# Altium schematic sheet 3_Power &amp; Peripherals.schdoc
size 307 x 218 mm; Symbol: Artery_A4; Device: Artery_A4; @Project Name: AT-START-F422/F426; @Page Count: 4; @Create Date: 2025-04-14; Company: Artery Technology; Drawed: SD; Version: 1.0; Page Size: A4; @Update Date: 2025-04-14; @Page No: 3; @Schematic Name: AT-START-F426-V1.0; @Page Name: Power &amp; Peripherals; Title Block Position: 3; Width: 1170; Height: 825; Region Start: 1; X Region Count: 6; Y Region Count: 4; Blade Width: 10; @Board Name: AT-START-F426-V1.0; @Create Time: 11:42:27; @Update Time: 14:57:24
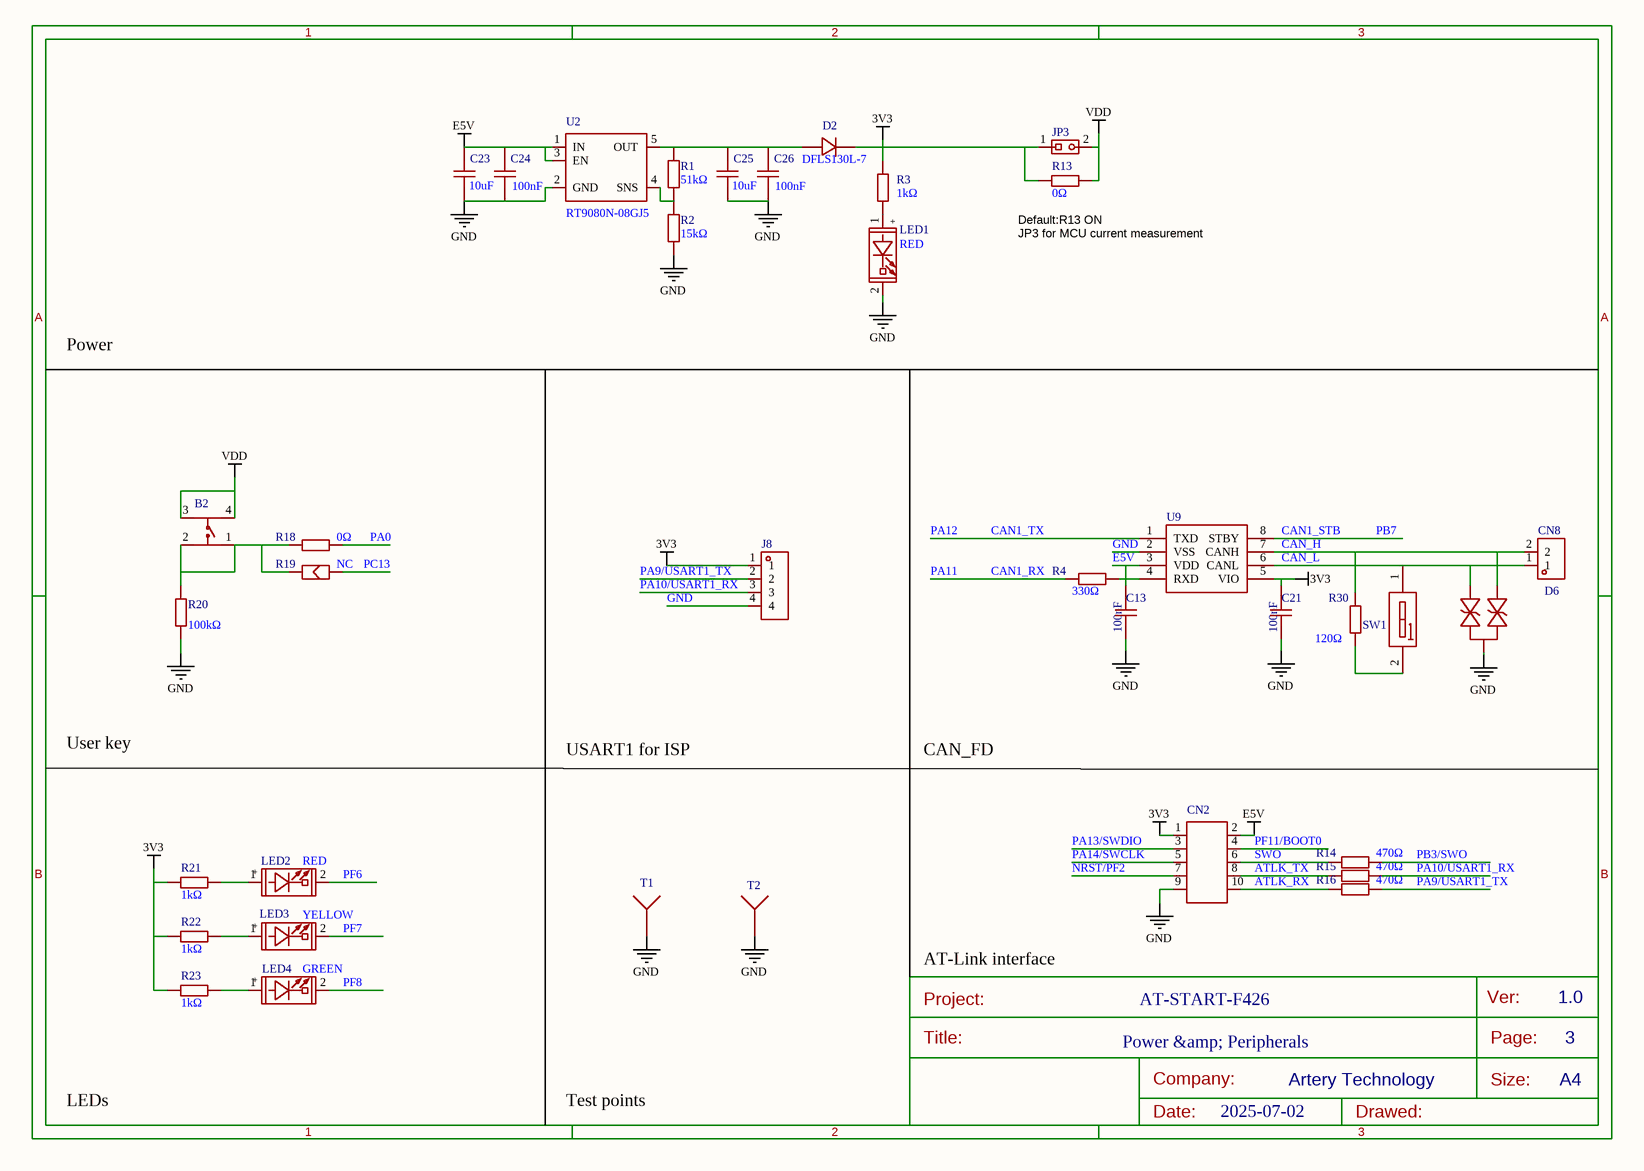
[diagram p0: 3_Power &amp; Peripherals.schdoc]

## Parts
B2  TSA063G60-250  [KEY-SMD_4P-L6.1-W6.1-P4.50-LS9.0]  (value not drawn)
C13  100nF  [C0603]
C21  100nF  [C0603]
C23  10uF  [C0603]
C24  100nF  [C0603]
C25  10uF  [C0603]
C26  100nF  [C0603]
CN2  CON10  [HDR2X5]  (value not drawn)
CN8  KF301-5.0-2P  [CONN-TH_P5.00_KF301-5.0-2P]  (value not drawn)
D2  DFLS130L-7  [POWERDI-123_L2.8-W1.8-LS3.7-RD]
D6  PESD2CANFD24V-TR  [SOT-23-3_L2.9-W1.3-P1.90-LS2.4-BR]  (value not drawn)
J8  PZ2.54-1*4-WZ  [HDR-TH_4P-P2.54-H-M-W7.7-P]  (value not drawn)
JP3  1X2P_2.54M  [HDR1X2]  (value not drawn)
LED1  RED  [LED0603]
LED2  RED  [LED0603]
LED3  YELLOW  [LED0603]
LED4  GREEN  [LED0603]
R1  51kΩ  [R0603]
R2  15kΩ  [R0603]
R3  1kΩ  [R0603]
R4  330Ω  [R0603]
R13  0Ω  [SB-PAD_2]
R14  470Ω  [R0603]
R15  470Ω  [R0603]
R16  470Ω  [R0603]
R18  0Ω  [SB-PAD_2]
R19  NC  [SB-PAD_2]
R20  100kΩ  [R0603]
R21  1kΩ  [R0603]
R22  1kΩ  [R0603]
R23  1kΩ  [R0603]
R30  120Ω  [R0603]
SW1  DSWB01LHGET  [SW-TH_DSWB01LHGET]  (value not drawn)
T1  Test point  [TestPoint]  (value not drawn)
T2  Test point  [TestPoint]  (value not drawn)
U2  RT9080N-08GJ5  [SOT-23-5]
U9  MCP2562FD-E/SN  [SOIC-8_L4.9-W3.9-P1.27-LS6.0-BL]  (value not drawn)

## Nets
3V3: C21.2 CN2.1 D2.1 J8.1 JP3.1 R3.2 R13.2 R21.2 R22.2 R23.2 U9.5(VIO)
E5V: C13.2 C23.1 C24.1 CN2.2 U2.1(IN) U2.3(EN) U9.3(VDD)
GND: C13.1 C21.1 C23.2 C24.2 C25.2 C26.2 CN2.9 D6.3 J8.4 LED1.2(CATHODE) R2.2 R20.2 T1.1 T2.1 U2.2(GND) U9.2(VSS)
VDD: B2.3 B2.4 JP3.2 R13.1
ATLK_RX: CN2.10 R16.2
ATLK_TX: CN2.8 R15.2
CAN1_RX: R4.1  [also labelled PA11]
CAN1_STB: U9.8(STBY)  [also labelled PB7]
CAN1_TX: U9.1(TXD)  [also labelled PA12]
CAN_H: CN8.2 D6.1 R30.2 U9.7(CANH)
CAN_L: CN8.1 D6.2 SW1.1(A1) U9.6(CANL)
NRST/PF2: CN2.7
PA0: R18.1
PA9/USART1_TX: J8.2 R16.1
PA10/USART1_RX: J8.3 R15.1
PA13/SWDIO: CN2.3
PA14/SWCLK: CN2.5
PB3/SWO: R14.1
PC13: R19.1
PF6: LED2.2(CATHODE)
PF7: LED3.2(CATHODE)
PF8: LED4.2(CATHODE)
PF11/BOOT0: CN2.4
SWO: CN2.6 R14.2
NetB2_1: B2.1 B2.2 R18.2 R19.2 R20.1
NetC25_1: C25.1 C26.1 D2.2 R1.1 U2.5(OUT)
NetLED1_1: LED1.1(ANODE) R3.1
NetLED2_1: LED2.1(ANODE) R21.1
NetLED3_1: LED3.1(ANODE) R22.1
NetLED4_1: LED4.1(ANODE) R23.1
NetR1_2: R1.2 R2.1 U2.4(SNS)
NetR4_2: R4.2 U9.4(RXD)
NetR30_1: R30.1 SW1.2

## Notes on the sheet
- (near R13) JP3 for MCU current measurement
- (near R13) Default:R13 ON
- Power
- User key
- USART1 for ISP
- CAN_FD
- AT-Link interface
- AT-START-F426
- LEDs
- Test points
- 2025-07-02
- 1
- 2
- 3
- A
- B
- Title:
- Project:
- Power &amp; Peripherals
- Page:
- Ver:
- 1.0
- Date:
- Company:
- Drawed:
- Artery Technology
- Size:
- A4
- (in symbol GREEN) +
- (in symbol RED) +
- (in symbol YELLOW) +

## Library data of the parts
B2 = TSA063G60-250: Manufacturer: BRIGHT(博瑞泰); Add into BOM: yes; Circuit: 单刀单掷; Actuator Style: 圆形按钮; Operating Force: 250gf; Switch Length: 6.1mm; Switch Height: 6mm; Strike Gundam: 不带; Contact Current: 50mA; Voltage Rating (DC): 12V; Insulation Resistance: 100MΩ; Actuator/Cap Color: 黑色; With Lamp: 无; Pin Style: 鸥翼型; Mechanical Life: 5万次; Origin Footprint: KEY_SOP_6*6; Symbol: TSA063G60-250; Device: TSA063G60-250; LCSC Part Name: 6.1*6.1*6mm 立贴 轻触开关; Supplier Part: C294566; Manufacturer Part: TSA063G60-250; Supplier Footprint: SMD; JLCPCB Part Class: Extended Part; Datasheet: https://atta.szlcsc.com/upload/public/pdf/source/20181029/C294570_15EFF1F4D215547575AD6307D8A439BB.pdf; Supplier: LCSC; Convert to PCB: yes; Mounting Style: 立贴; Switch Width: 6.1mm; Operating Temperature: -25℃~+70℃; Design Item ID: Push_Bottom,Blue,SMD_2P; Library Name: *
C13 C21 = CC0603KRX7R9BB104: Manufacturer: YAGEO(国巨); Add into BOM: yes; Tolerance: ±10%; Voltage Rated: 50V; Temperature Coefficient: X7R; Symbol: CC0603KRX7R9BB104; Device: CC0603KRX7R9BB104; Supplier: LCSC; Manufacturer Part: CC0603KRX7R9BB104; Value: 100nF; Supplier Part: C14663; JLCPCB Part Class: Basic Part; LCSC Part Name: 100nF ±10% 50V; Supplier Footprint: 0603; Datasheet: https://atta.szlcsc.com/upload/public/pdf/source/20180910/C282072_33301C7F631E79921B82A8DAC6BCC5B3.pdf; Convert to PCB: yes
C23 C25 = CL10A106KP8NNNC: Manufacturer: SAMSUNG(三星); Add into BOM: yes; Tolerance: ±10%; Voltage Rated: 10V; Temperature Coefficient: X5R; Origin Footprint: 0603_C-M; Symbol: CL10A106KP8NNNC; Device: CL10A106KP8NNNC; Supplier: LCSC; Manufacturer Part: CL10A106KP8NNNC; Value: 10uF; Supplier Part: C19702; JLCPCB Part Class: Basic Part; LCSC Part Name: 10uF ±10% 10V; Supplier Footprint: 0603; Datasheet: https://atta.szlcsc.com/upload/public/pdf/source/20160218/1457707763339.pdf; Convert to PCB: yes
C24 C26 = CC0603KRX7R9BB104: Manufacturer: YAGEO(国巨); Add into BOM: yes; Tolerance: ±10%; Voltage Rated: 50V; Temperature Coefficient: X7R; Origin Footprint: 0603_C-M; Symbol: CC0603KRX7R9BB104; Device: CC0603KRX7R9BB104; Supplier: LCSC; Manufacturer Part: CC0603KRX7R9BB104; Value: 100nF; Supplier Part: C14663; JLCPCB Part Class: Basic Part; LCSC Part Name: 100nF ±10% 50V; Supplier Footprint: 0603; Datasheet: https://atta.szlcsc.com/upload/public/pdf/source/20180910/C282072_33301C7F631E79921B82A8DAC6BCC5B3.pdf; Convert to PCB: yes
CN2 = CON10: Symbol: CON10A_0; Add into BOM: yes; Device: CON10; Convert to PCB: yes; Origin Footprint: HDR2X5; Design Item ID: CON10A_0; Library Name: *
CN8 = KF301-5.0-2P: Manufacturer: KEFA(科发); Add into BOM: yes; Structure: 1x2P; Pitch: 5mm; Current Rating (Max): 17A; Voltage Rating (Max): 250V; Wire Gauge - AWG: 14~22; Wire Gauge - mm2: 1.5; Number of PINs Per Row: 2; Symbol: KF301-5.0-2P; Device: KF301-5.0-2P; LCSC Part Name: 5mm 1x2P 排数:1 每排P数:2 直插; Supplier Part: C474881; Manufacturer Part: KF301-5.0-2P; Supplier Footprint: 插件,P=5mm; JLCPCB Part Class: 扩展库; Datasheet: https://atta.szlcsc.com/upload/public/pdf/source/20230317/03A5B5FC229D6F9225E8F51DA1A4E80A.pdf; Supplier: LCSC; Convert to PCB: yes; Color: 蓝色; Mounting Style: 直插; Number of Pins: 2P; Number of Rows: 1; Operating Temperature Range: -30℃~+120℃
D2 = DFLS130L-7: Manufacturer: DIODES(美台); Add into BOM: yes; Forward Voltage (Vf@If): 310mV@1A; Reverse Voltage (Vr): 30V; Average Rectified Current (Io): 1A; Origin Footprint: SOD-123; Symbol: DFLS130L-7; Device: DFLS130L-7; LCSC Part Name: 电压:30V 电流:1A; Supplier Part: C110493; Manufacturer Part: DFLS130L-7; Supplier Footprint: Power-DI-123; JLCPCB Part Class: Extended Part; Datasheet: https://atta.szlcsc.com/upload/public/pdf/source/20170427/1493286393645.pdf; Supplier: LCSC; Convert to PCB: yes; Design Item ID: Diode; Library Name: Miscellaneous Devices; Published: 8-Jun-2000; LatestRevisionDate: 17-Jul-2002; LatestRevisionNote: Re-released for DXP Platform.; PackageVersion: Sep-1996; PackageReference: SMC; Publisher: Altium Limited; PackageDescription: DO-214-AB/SMC; 2 C-Bend Leads; Body 7.9 x 5.9 mm, inc. leads (LxW); Code_JEDEC: DO-214-AB
D6 = PESD2CANFD24V-TR: Manufacturer: Nexperia(安世); Add into BOM: yes; Reverse Stand-Off Voltage (Vrwm): 24V; Maximum Clamping Voltage: 42V; Breakdown Voltage: 25.5V; Type: ESD; Symbol: PESD2CANFD24V-TR; Device: PESD2CANFD24V-TR; LCSC Part Name: PESD2CANFD24V-TR; Supplier Part: C552486; Manufacturer Part: PESD2CANFD24V-TR; Supplier Footprint: SOT-23; JLCPCB Part Class: Extended Part; Datasheet: https://atta.szlcsc.com/upload/public/pdf/source/20200610/C552486_699511E714443C7808A8CCDBC78334D2.pdf; Supplier: LCSC; Convert to PCB: yes; Peak Pulse Power Dissipation (Ppp)@10/1000us: -; Operating Temperature: -55℃~+175℃@(Ta)
J8 = PZ2.54-1*4-WZ: Manufacturer: ZHOURI(洲日); Add into BOM: yes; Pin Structure: 1x4P; Pitch: 2.54mm; Origin Footprint: HDR1X4; Symbol: PZ2.54-1*4-WZ; Device: PZ2.54-1*4-WZ; LCSC Part Name: PZ2.54-1*4-WZ; Supplier Part: C5224015; Manufacturer Part: PZ2.54-1*4-WZ; Supplier Footprint: 弯插,P=2.54mm; JLCPCB Part Class: Extended Part; Datasheet: https://atta.szlcsc.com/upload/public/pdf/source/20221031/5E07F614DEAC37F80EB82945E6A3298C.pdf; Supplier: LCSC; Convert to PCB: yes; Mounting Type: 弯插; Number of Rows: 单排; Number of Pins: 4P; Contact Plating: 金; Design Item ID: Header 4; Library Name: Miscellaneous Connectors; LatestRevisionDate: 17-Jul-2002; LatestRevisionNote: Re-released for DXP Platform.; Publisher: Altium Limited
JP3 = 1X2P_2.54M: Symbol: 1X2P,Male,DIP_2.54; Origin Footprint 2: SIP_2P; Add into BOM: yes; Check: true; Device: 1X2P_2.54M; Convert to PCB: yes; Origin Footprint 1: HDR1X2; Design Item ID: 1X2P,Male,DIP_2.54; Library Name: *
LED1 LED2 = RED: Symbol: RED,SMD0603; Add into BOM: yes; Device: RED; Convert to PCB: yes; Origin Footprint: LED0603; Design Item ID: RED,SMD0603; Library Name: AT32F403_TINY_LQFP144_Library
LED3 = YELLOW: Symbol: YELLOW,SMD0603; Add into BOM: yes; Device: YELLOW; Convert to PCB: yes; Origin Footprint: LED0603; Design Item ID: YELLOW,SMD0603; Library Name: Schlib1
LED4 = GREEN: Symbol: GREEN,SMD0603; Add into BOM: yes; Device: GREEN; Convert to PCB: yes; Origin Footprint: LED0603; Design Item ID: GREEN,SMD0603; Library Name: AT32F403_TINY_LQFP144_Library
R1 = 0603WAF5102T5E: Manufacturer: UNI-ROYAL(厚声); Add into BOM: yes; Tolerance: ±1%; Power(Watts): 100mW; Overload Voltage (Max): 75V; Temperature Coefficient: ±100ppm/℃; Symbol: 0603WAF5102T5E; Device: 0603WAF5102T5E; Supplier: LCSC; Manufacturer Part: 0603WAF5102T5E; Supplier Part: C23196; Value: 51kΩ; JLCPCB Part Class: Basic Part; LCSC Part Name: 51kΩ ±1% 100mW 厚膜电阻; Supplier Footprint: 0603; Datasheet: https://atta.szlcsc.com/upload/public/pdf/source/20200306/C422600_1E6D84923E4A46A82E41ADD87F860B5C.pdf; Convert to PCB: yes; Type: 厚膜电阻; Operating Temperature Range: -55℃~+155℃; Origin Footprint: R0603; Design Item ID: 470,1/10W,1%,SMD0603; Library Name: *
R2 = 0603WAF1502T5E: Manufacturer: UNI-ROYAL(厚声); Add into BOM: yes; Tolerance: ±1%; Power(Watts): 100mW; Overload Voltage (Max): 75V; Temperature Coefficient: ±100ppm/℃; Symbol: 0603WAF1502T5E; Device: 0603WAF1502T5E; Supplier: LCSC; Manufacturer Part: 0603WAF1502T5E; Supplier Part: C22809; Value: 15kΩ; JLCPCB Part Class: Basic Part; LCSC Part Name: 15kΩ ±1% 100mW 厚膜电阻; Supplier Footprint: 0603; Datasheet: https://atta.szlcsc.com/upload/public/pdf/source/20200306/C422600_1E6D84923E4A46A82E41ADD87F860B5C.pdf; Convert to PCB: yes; Type: 厚膜电阻; Operating Temperature Range: -55℃~+155℃; Origin Footprint: R0603; Design Item ID: 470,1/10W,1%,SMD0603; Library Name: *
R3 R21-R23 = 0603WAF1001T5E: Manufacturer: UNI-ROYAL(厚声); Add into BOM: yes; Tolerance: ±1%; Power(Watts): 100mW; Overload Voltage (Max): 75V; Temperature Coefficient: ±100ppm/℃; Symbol: 0603WAF1001T5E; Device: 0603WAF1001T5E; Supplier: LCSC; Manufacturer Part: 0603WAF1001T5E; Supplier Part: C21190; Value: 1kΩ; JLCPCB Part Class: Basic Part; LCSC Part Name: 1kΩ ±1% 100mW 厚膜电阻; Supplier Footprint: 0603; Datasheet: https://atta.szlcsc.com/upload/public/pdf/source/20200306/C422600_1E6D84923E4A46A82E41ADD87F860B5C.pdf; Convert to PCB: yes; Type: 厚膜电阻; Operating Temperature Range: -55℃~+155℃; Origin Footprint: R0603; Design Item ID: 470,1/10W,1%,SMD0603; Library Name: *
R4 = 0603WAF3300T5E: Manufacturer: UNI-ROYAL(厚声); Add into BOM: yes; Tolerance: ±1%; Power(Watts): 100mW; Overload Voltage (Max): 75V; Temperature Coefficient: ±100ppm/℃; Symbol: 0603WAF3300T5E; Device: 0603WAF3300T5E; LCSC Part Name: 330Ω ±1% 100mW 厚膜电阻; Supplier Part: C23138; Manufacturer Part: 0603WAF3300T5E; Supplier Footprint: 0603; JLCPCB Part Class: 基础库; Datasheet: https://atta.szlcsc.com/upload/public/pdf/source/20200306/C422600_1E6D84923E4A46A82E41ADD87F860B5C.pdf; Supplier: LCSC; Convert to PCB: yes; Type: 厚膜电阻; Value: 330Ω; Operating Temperature Range: -55℃~+155℃
R13 R18 = 0603WAF0000T5E: Manufacturer: UNI-ROYAL(厚声); Add into BOM: yes; Tolerance: ±1%; Power(Watts): 100mW; Overload Voltage (Max): 75V; Origin Footprint: SB-PAD; Symbol: 0603WAF0000T5E; Device: 0603WAF0000T5E; Supplier: LCSC; Manufacturer Part: 0603WAF0000T5E; Supplier Part: C21189; Value: 0Ω; JLCPCB Part Class: Basic Part; LCSC Part Name: 0Ω ±1% 100mW 厚膜电阻; Supplier Footprint: 0603; Datasheet: https://atta.szlcsc.com/upload/public/pdf/source/20200306/C422600_1E6D84923E4A46A82E41ADD87F860B5C.pdf; Convert to PCB: yes; Type: 厚膜电阻; Operating Temperature Range: -55℃~+155℃; Design Item ID: 470,1/10W,1%,SMD0603; Library Name: *
R14-R16 = 0603WAF4700T5E: Manufacturer: UNI-ROYAL(厚声); Add into BOM: yes; Tolerance: ±1%; Power(Watts): 100mW; Overload Voltage (Max): 75V; Temperature Coefficient: ±100ppm/℃; Origin Footprint: 0603_R-M; Symbol: 0603WAF4700T5E; Device: 0603WAF4700T5E; LCSC Part Name: 470Ω ±1% 100mW 厚膜电阻; Supplier Part: C23179; Manufacturer Part: 0603WAF4700T5E; Supplier Footprint: 0603; JLCPCB Part Class: Basic Part; Datasheet: https://atta.szlcsc.com/upload/public/pdf/source/20200306/C422600_1E6D84923E4A46A82E41ADD87F860B5C.pdf; Supplier: LCSC; Convert to PCB: yes; Type: 厚膜电阻; Value: 470Ω; Operating Temperature Range: -55℃~+155℃
R19 = SB_PAD: Symbol: SB-PAD; Convert to PCB: yes; Device: SB_PAD; Add into BOM: yes; Origin Footprint: SB-PAD; Design Item ID: 470,1/10W,1%,SMD0603; Library Name: *
R20 = 0603WAF1003T5E: Manufacturer: UNI-ROYAL(厚声); Add into BOM: yes; Tolerance: ±1%; Power(Watts): 100mW; Overload Voltage (Max): 75V; Temperature Coefficient: ±100ppm/℃; Symbol: 0603WAF1003T5E; Device: 0603WAF1003T5E; LCSC Part Name: 100kΩ ±1% 100mW 厚膜电阻; Supplier Part: C25803; Manufacturer Part: 0603WAF1003T5E; Supplier Footprint: 0603; JLCPCB Part Class: Basic Part; Datasheet: https://atta.szlcsc.com/upload/public/pdf/source/20200306/C422600_1E6D84923E4A46A82E41ADD87F860B5C.pdf; Supplier: LCSC; Convert to PCB: yes; Type: 厚膜电阻; Value: 100kΩ; Operating Temperature Range: -55℃~+155℃; Origin Footprint: R0603; Design Item ID: 10K,1/10W,1%,SMD0603; Library Name: *
R30 = 0603WAF1200T5E: Manufacturer: UNI-ROYAL(厚声); Add into BOM: yes; Tolerance: ±1%; Power(Watts): 100mW; Overload Voltage (Max): 75V; Temperature Coefficient: ±100ppm/℃; Symbol: 0603WAF1200T5E; Device: 0603WAF1200T5E; LCSC Part Name: 120Ω ±1% 100mW 厚膜电阻; Supplier Part: C22787; Manufacturer Part: 0603WAF1200T5E; Supplier Footprint: 0603; JLCPCB Part Class: 基础库; Datasheet: https://atta.szlcsc.com/upload/public/pdf/source/20200306/C422600_1E6D84923E4A46A82E41ADD87F860B5C.pdf; Supplier: LCSC; Convert to PCB: yes; Type: 厚膜电阻; Value: 120Ω; Operating Temperature Range: -55℃~+155℃
SW1 = DSWB01LHGET: Manufacturer: YE; Add into BOM: yes; Circuit: 单刀单掷; Number of Positions: 1位; Symbol: DSWB01LHGET; Device: DSWB01LHGET; LCSC Part Name: 红色宽体1位顶拨插件; Supplier Part: C126888; Manufacturer Part: DSWB01LHGET; Supplier Footprint: 插件,9.9x4mm; JLCPCB Part Class: 扩展库; Datasheet: https://atta.szlcsc.com/upload/public/pdf/source/20240423/2AB41BE17D24959C6789B2A71E54D492.pdf; Supplier: LCSC; Convert to PCB: yes; Type: 平拨,凸起式; Lead Pitch: -; Operating Life: -; Color: 红色
T1 T2 = Test point: Symbol: Socket; Add into BOM: yes; Device: Test point; LatestRevisionDate: 17-Jul-2002; LatestRevisionNote: Re-released for DXP Platform.; Publisher: Altium Limited; Convert to PCB: yes; Origin Footprint: TestPoint; Design Item ID: Socket; Library Name: Miscellaneous Connectors
U2 = RT9080N-08GJ5: Add into BOM: yes; Symbol: RT9080N; Device: RT9080N-08GJ5; Convert to PCB: yes; Origin Footprint: SOT-23-5; Design Item ID: RT9080N; Library Name: SCM_START_402F
U9 = MCP2562FD-E/SN: Manufacturer: MICROCHIP(美国微芯); Add into BOM: yes; Data Rate: 8Mbps; Supply Voltage: 4.5V~5.5V; Symbol: MCP2562FD-E/SN; Device: MCP2562FD-E/SN; LCSC Part Name: 8Mbps 4.5V~5.5V; Supplier Part: C124016; Manufacturer Part: MCP2562FD-E/SN; Supplier Footprint: SOIC-8; JLCPCB Part Class: 扩展库; Datasheet: https://atta.szlcsc.com/upload/public/pdf/source/20220205/C2671849_849BA51C0C21A8BD9D21DE0254A7F304.pdf; Supplier: LCSC; Convert to PCB: yes; Type: 收发器; Operating Temperature: -40℃~+125℃